# EAGLE design PCB_v1 (EAGLE 9.5.2)
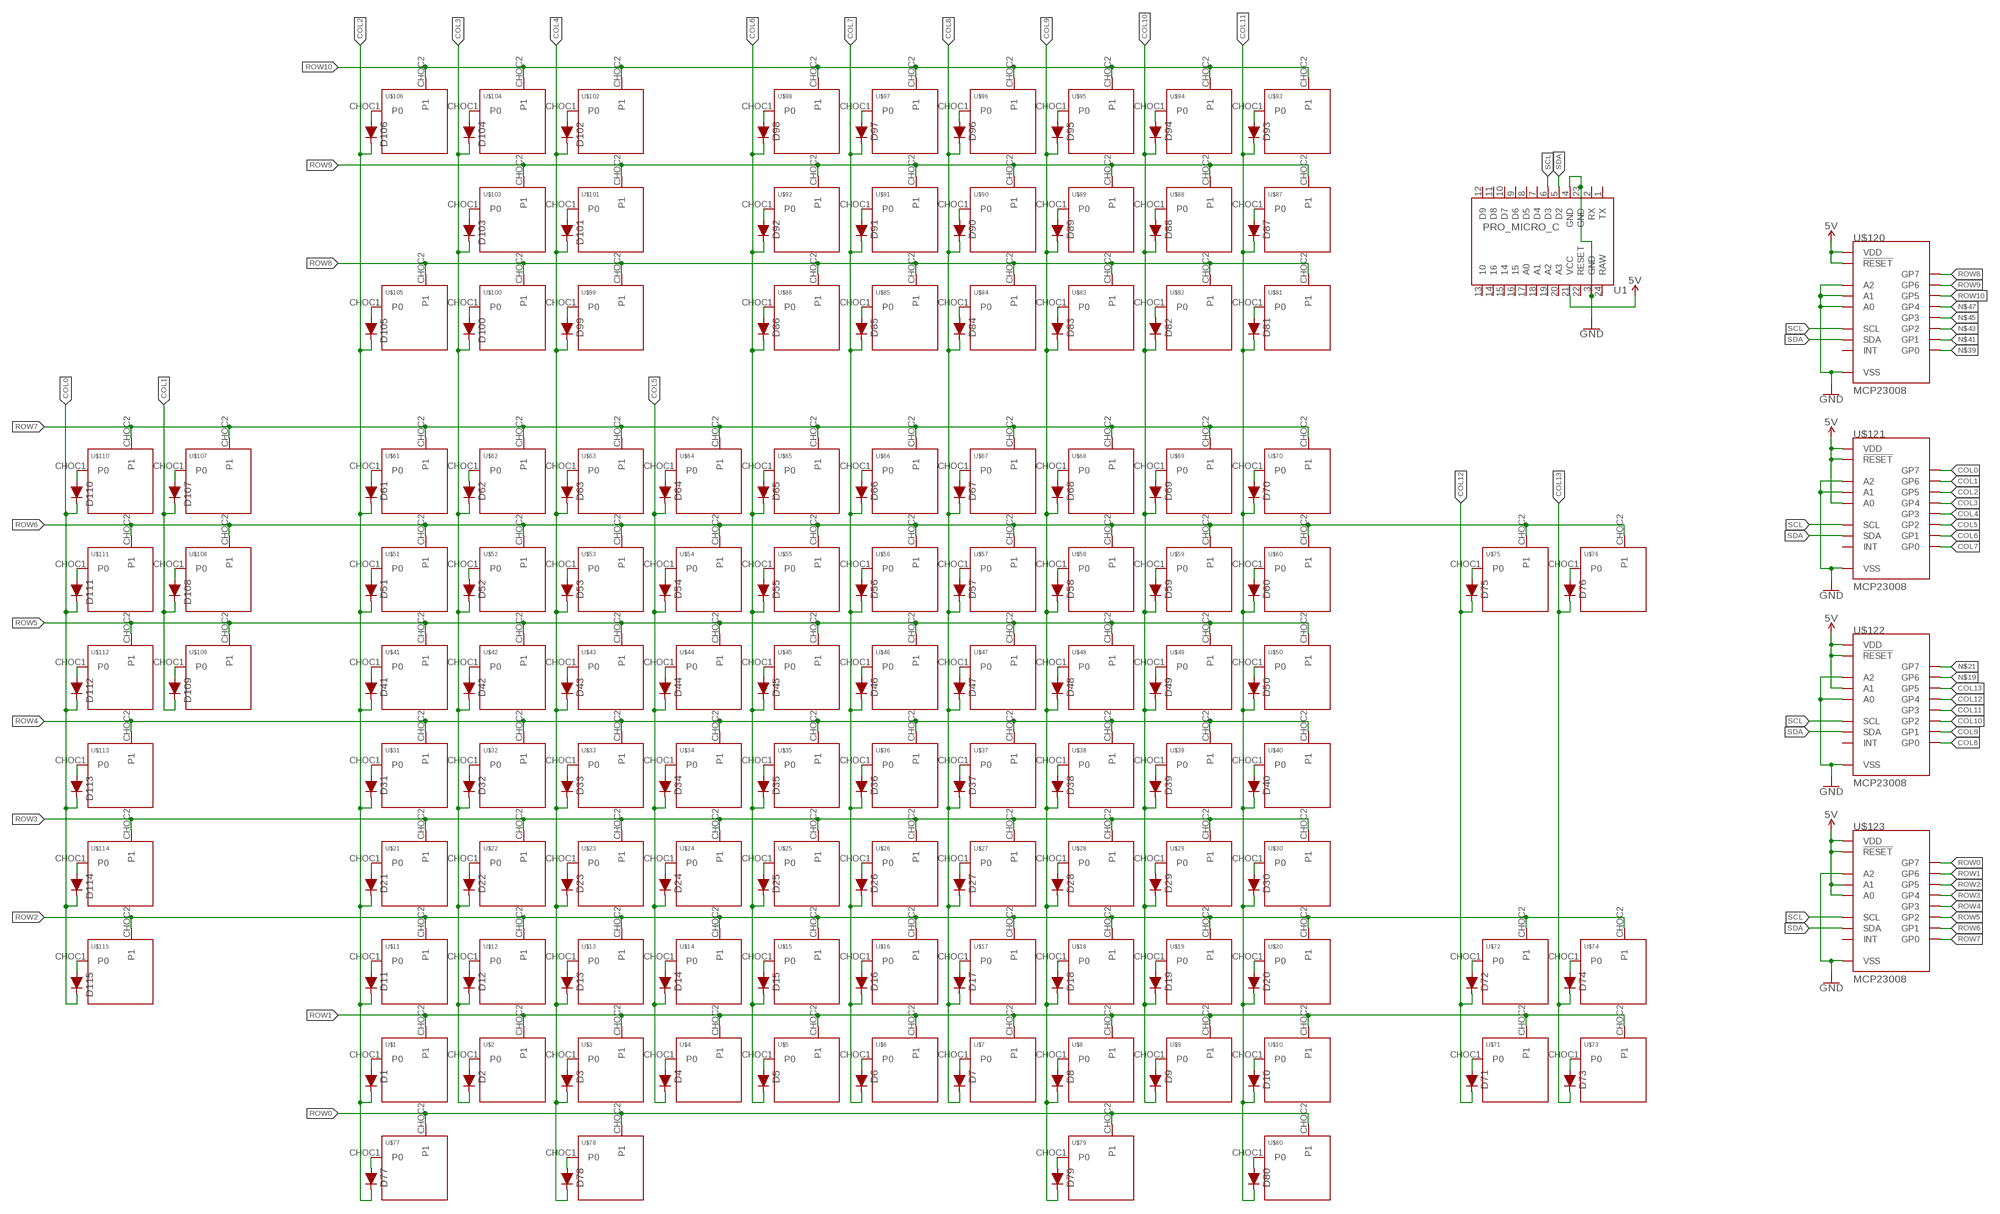
[diagram p0: schematic, sheet 1]

## Parts
D1  200mA/100V/1V  DIODE-KIT  [DIODE-1N4148-KIT]
D2  200mA/100V/1V  DIODE-KIT  [DIODE-1N4148-KIT]
D3  200mA/100V/1V  DIODE-KIT  [DIODE-1N4148-KIT]
D4  200mA/100V/1V  DIODE-KIT  [DIODE-1N4148-KIT]
D5  200mA/100V/1V  DIODE-KIT  [DIODE-1N4148-KIT]
D6  200mA/100V/1V  DIODE-KIT  [DIODE-1N4148-KIT]
D7  200mA/100V/1V  DIODE-KIT  [DIODE-1N4148-KIT]
D8  200mA/100V/1V  DIODE-KIT  [DIODE-1N4148-KIT]
D9  200mA/100V/1V  DIODE-KIT  [DIODE-1N4148-KIT]
D10  200mA/100V/1V  DIODE-KIT  [DIODE-1N4148-KIT]
D11  200mA/100V/1V  DIODE-KIT  [DIODE-1N4148-KIT]
D12  200mA/100V/1V  DIODE-KIT  [DIODE-1N4148-KIT]
D13  200mA/100V/1V  DIODE-KIT  [DIODE-1N4148-KIT]
D14  200mA/100V/1V  DIODE-KIT  [DIODE-1N4148-KIT]
D15  200mA/100V/1V  DIODE-KIT  [DIODE-1N4148-KIT]
D16  200mA/100V/1V  DIODE-KIT  [DIODE-1N4148-KIT]
D17  200mA/100V/1V  DIODE-KIT  [DIODE-1N4148-KIT]
D18  200mA/100V/1V  DIODE-KIT  [DIODE-1N4148-KIT]
D19  200mA/100V/1V  DIODE-KIT  [DIODE-1N4148-KIT]
D20  200mA/100V/1V  DIODE-KIT  [DIODE-1N4148-KIT]
D21  200mA/100V/1V  DIODE-KIT  [DIODE-1N4148-KIT]
D22  200mA/100V/1V  DIODE-KIT  [DIODE-1N4148-KIT]
D23  200mA/100V/1V  DIODE-KIT  [DIODE-1N4148-KIT]
D24  200mA/100V/1V  DIODE-KIT  [DIODE-1N4148-KIT]
D25  200mA/100V/1V  DIODE-KIT  [DIODE-1N4148-KIT]
D26  200mA/100V/1V  DIODE-KIT  [DIODE-1N4148-KIT]
D27  200mA/100V/1V  DIODE-KIT  [DIODE-1N4148-KIT]
D28  200mA/100V/1V  DIODE-KIT  [DIODE-1N4148-KIT]
D29  200mA/100V/1V  DIODE-KIT  [DIODE-1N4148-KIT]
D30  200mA/100V/1V  DIODE-KIT  [DIODE-1N4148-KIT]
D31  200mA/100V/1V  DIODE-KIT  [DIODE-1N4148-KIT]
D32  200mA/100V/1V  DIODE-KIT  [DIODE-1N4148-KIT]
D33  200mA/100V/1V  DIODE-KIT  [DIODE-1N4148-KIT]
D34  200mA/100V/1V  DIODE-KIT  [DIODE-1N4148-KIT]
D35  200mA/100V/1V  DIODE-KIT  [DIODE-1N4148-KIT]
D36  200mA/100V/1V  DIODE-KIT  [DIODE-1N4148-KIT]
D37  200mA/100V/1V  DIODE-KIT  [DIODE-1N4148-KIT]
D38  200mA/100V/1V  DIODE-KIT  [DIODE-1N4148-KIT]
D39  200mA/100V/1V  DIODE-KIT  [DIODE-1N4148-KIT]
D40  200mA/100V/1V  DIODE-KIT  [DIODE-1N4148-KIT]
D41  200mA/100V/1V  DIODE-KIT  [DIODE-1N4148-KIT]
D42  200mA/100V/1V  DIODE-KIT  [DIODE-1N4148-KIT]
D43  200mA/100V/1V  DIODE-KIT  [DIODE-1N4148-KIT]
D44  200mA/100V/1V  DIODE-KIT  [DIODE-1N4148-KIT]
D45  200mA/100V/1V  DIODE-KIT  [DIODE-1N4148-KIT]
D46  200mA/100V/1V  DIODE-KIT  [DIODE-1N4148-KIT]
D47  200mA/100V/1V  DIODE-KIT  [DIODE-1N4148-KIT]
D48  200mA/100V/1V  DIODE-KIT  [DIODE-1N4148-KIT]
D49  200mA/100V/1V  DIODE-KIT  [DIODE-1N4148-KIT]
D50  200mA/100V/1V  DIODE-KIT  [DIODE-1N4148-KIT]
D51  200mA/100V/1V  DIODE-KIT  [DIODE-1N4148-KIT]
D52  200mA/100V/1V  DIODE-KIT  [DIODE-1N4148-KIT]
D53  200mA/100V/1V  DIODE-KIT  [DIODE-1N4148-KIT]
D54  200mA/100V/1V  DIODE-KIT  [DIODE-1N4148-KIT]
D55  200mA/100V/1V  DIODE-KIT  [DIODE-1N4148-KIT]
D56  200mA/100V/1V  DIODE-KIT  [DIODE-1N4148-KIT]
D57  200mA/100V/1V  DIODE-KIT  [DIODE-1N4148-KIT]
D58  200mA/100V/1V  DIODE-KIT  [DIODE-1N4148-KIT]
D59  200mA/100V/1V  DIODE-KIT  [DIODE-1N4148-KIT]
D60  200mA/100V/1V  DIODE-KIT  [DIODE-1N4148-KIT]
D61  200mA/100V/1V  DIODE-KIT  [DIODE-1N4148-KIT]
D62  200mA/100V/1V  DIODE-KIT  [DIODE-1N4148-KIT]
D63  200mA/100V/1V  DIODE-KIT  [DIODE-1N4148-KIT]
D64  200mA/100V/1V  DIODE-KIT  [DIODE-1N4148-KIT]
D65  200mA/100V/1V  DIODE-KIT  [DIODE-1N4148-KIT]
D66  200mA/100V/1V  DIODE-KIT  [DIODE-1N4148-KIT]
D67  200mA/100V/1V  DIODE-KIT  [DIODE-1N4148-KIT]
D68  200mA/100V/1V  DIODE-KIT  [DIODE-1N4148-KIT]
D69  200mA/100V/1V  DIODE-KIT  [DIODE-1N4148-KIT]
D70  200mA/100V/1V  DIODE-KIT  [DIODE-1N4148-KIT]
D71  200mA/100V/1V  DIODE-KIT  [DIODE-1N4148-KIT]
D72  200mA/100V/1V  DIODE-KIT  [DIODE-1N4148-KIT]
D73  200mA/100V/1V  DIODE-KIT  [DIODE-1N4148-KIT]
D74  200mA/100V/1V  DIODE-KIT  [DIODE-1N4148-KIT]
D75  200mA/100V/1V  DIODE-KIT  [DIODE-1N4148-KIT]
D76  200mA/100V/1V  DIODE-KIT  [DIODE-1N4148-KIT]
D77  200mA/100V/1V  DIODE-KIT  [DIODE-1N4148-KIT]
D78  200mA/100V/1V  DIODE-KIT  [DIODE-1N4148-KIT]
D79  200mA/100V/1V  DIODE-KIT  [DIODE-1N4148-KIT]
D80  200mA/100V/1V  DIODE-KIT  [DIODE-1N4148-KIT]
D81  200mA/100V/1V  DIODE-KIT  [DIODE-1N4148-KIT]
D82  200mA/100V/1V  DIODE-KIT  [DIODE-1N4148-KIT]
D83  200mA/100V/1V  DIODE-KIT  [DIODE-1N4148-KIT]
D84  200mA/100V/1V  DIODE-KIT  [DIODE-1N4148-KIT]
D85  200mA/100V/1V  DIODE-KIT  [DIODE-1N4148-KIT]
D86  200mA/100V/1V  DIODE-KIT  [DIODE-1N4148-KIT]
D87  200mA/100V/1V  DIODE-KIT  [DIODE-1N4148-KIT]
D88  200mA/100V/1V  DIODE-KIT  [DIODE-1N4148-KIT]
D89  200mA/100V/1V  DIODE-KIT  [DIODE-1N4148-KIT]
D90  200mA/100V/1V  DIODE-KIT  [DIODE-1N4148-KIT]
D91  200mA/100V/1V  DIODE-KIT  [DIODE-1N4148-KIT]
D92  200mA/100V/1V  DIODE-KIT  [DIODE-1N4148-KIT]
D93  200mA/100V/1V  DIODE-KIT  [DIODE-1N4148-KIT]
D94  200mA/100V/1V  DIODE-KIT  [DIODE-1N4148-KIT]
D95  200mA/100V/1V  DIODE-KIT  [DIODE-1N4148-KIT]
D96  200mA/100V/1V  DIODE-KIT  [DIODE-1N4148-KIT]
D97  200mA/100V/1V  DIODE-KIT  [DIODE-1N4148-KIT]
D98  200mA/100V/1V  DIODE-KIT  [DIODE-1N4148-KIT]
D99  200mA/100V/1V  DIODE-KIT  [DIODE-1N4148-KIT]
D100  200mA/100V/1V  DIODE-KIT  [DIODE-1N4148-KIT]
D101  200mA/100V/1V  DIODE-KIT  [DIODE-1N4148-KIT]
D102  200mA/100V/1V  DIODE-KIT  [DIODE-1N4148-KIT]
D103  200mA/100V/1V  DIODE-KIT  [DIODE-1N4148-KIT]
D104  200mA/100V/1V  DIODE-KIT  [DIODE-1N4148-KIT]
D105  200mA/100V/1V  DIODE-KIT  [DIODE-1N4148-KIT]
D106  200mA/100V/1V  DIODE-KIT  [DIODE-1N4148-KIT]
D107  200mA/100V/1V  DIODE-KIT  [DIODE-1N4148-KIT]
D108  200mA/100V/1V  DIODE-KIT  [DIODE-1N4148-KIT]
D109  200mA/100V/1V  DIODE-KIT  [DIODE-1N4148-KIT]
D110  200mA/100V/1V  DIODE-KIT  [DIODE-1N4148-KIT]
D111  200mA/100V/1V  DIODE-KIT  [DIODE-1N4148-KIT]
D112  200mA/100V/1V  DIODE-KIT  [DIODE-1N4148-KIT]
D113  200mA/100V/1V  DIODE-KIT  [DIODE-1N4148-KIT]
D114  200mA/100V/1V  DIODE-KIT  [DIODE-1N4148-KIT]
D115  200mA/100V/1V  DIODE-KIT  [DIODE-1N4148-KIT]
U1  PRO_MICRO_C  [PRO_MICRO_C]
U$1  KEYSWITCH-PLAIN-CHOC-1U  [CHOC-1U]
U$2  KEYSWITCH-PLAIN-CHOC-1U  [CHOC-1U]
U$3  KEYSWITCH-PLAIN-CHOC-1U  [CHOC-1U]
U$4  KEYSWITCH-PLAIN-CHOC-1U  [CHOC-1U]
U$5  KEYSWITCH-PLAIN-CHOC-1U  [CHOC-1U]
U$6  KEYSWITCH-PLAIN-CHOC-1U  [CHOC-1U]
U$7  KEYSWITCH-PLAIN-CHOC-1U  [CHOC-1U]
U$8  KEYSWITCH-PLAIN-CHOC-1U  [CHOC-1U]
U$9  KEYSWITCH-PLAIN-CHOC-1U  [CHOC-1U]
U$10  KEYSWITCH-PLAIN-CHOC-1U  [CHOC-1U]
U$11  KEYSWITCH-PLAIN-CHOC-1U  [CHOC-1U]
U$12  KEYSWITCH-PLAIN-CHOC-1U  [CHOC-1U]
U$13  KEYSWITCH-PLAIN-CHOC-1U  [CHOC-1U]
U$14  KEYSWITCH-PLAIN-CHOC-1U  [CHOC-1U]
U$15  KEYSWITCH-PLAIN-CHOC-1U  [CHOC-1U]
U$16  KEYSWITCH-PLAIN-CHOC-1U  [CHOC-1U]
U$17  KEYSWITCH-PLAIN-CHOC-1U  [CHOC-1U]
U$18  KEYSWITCH-PLAIN-CHOC-1U  [CHOC-1U]
U$19  KEYSWITCH-PLAIN-CHOC-1U  [CHOC-1U]
U$20  KEYSWITCH-PLAIN-CHOC-1U  [CHOC-1U]
U$21  KEYSWITCH-PLAIN-CHOC-1U  [CHOC-1U]
U$22  KEYSWITCH-PLAIN-CHOC-1U  [CHOC-1U]
U$23  KEYSWITCH-PLAIN-CHOC-1U  [CHOC-1U]
U$24  KEYSWITCH-PLAIN-CHOC-1U  [CHOC-1U]
U$25  KEYSWITCH-PLAIN-CHOC-1U  [CHOC-1U]
U$26  KEYSWITCH-PLAIN-CHOC-1U  [CHOC-1U]
U$27  KEYSWITCH-PLAIN-CHOC-1U  [CHOC-1U]
U$28  KEYSWITCH-PLAIN-CHOC-1U  [CHOC-1U]
U$29  KEYSWITCH-PLAIN-CHOC-1U  [CHOC-1U]
U$30  KEYSWITCH-PLAIN-CHOC-1U  [CHOC-1U]
U$31  KEYSWITCH-PLAIN-CHOC-1U  [CHOC-1U]
U$32  KEYSWITCH-PLAIN-CHOC-1U  [CHOC-1U]
U$33  KEYSWITCH-PLAIN-CHOC-1U  [CHOC-1U]
U$34  KEYSWITCH-PLAIN-CHOC-1U  [CHOC-1U]
U$35  KEYSWITCH-PLAIN-CHOC-1U  [CHOC-1U]
U$36  KEYSWITCH-PLAIN-CHOC-1U  [CHOC-1U]
U$37  KEYSWITCH-PLAIN-CHOC-1U  [CHOC-1U]
U$38  KEYSWITCH-PLAIN-CHOC-1U  [CHOC-1U]
U$39  KEYSWITCH-PLAIN-CHOC-1U  [CHOC-1U]
U$40  KEYSWITCH-PLAIN-CHOC-1U  [CHOC-1U]
U$41  KEYSWITCH-PLAIN-CHOC-1U  [CHOC-1U]
U$42  KEYSWITCH-PLAIN-CHOC-1U  [CHOC-1U]
U$43  KEYSWITCH-PLAIN-CHOC-1U  [CHOC-1U]
U$44  KEYSWITCH-PLAIN-CHOC-1U  [CHOC-1U]
U$45  KEYSWITCH-PLAIN-CHOC-1U  [CHOC-1U]
U$46  KEYSWITCH-PLAIN-CHOC-1U  [CHOC-1U]
U$47  KEYSWITCH-PLAIN-CHOC-1U  [CHOC-1U]
U$48  KEYSWITCH-PLAIN-CHOC-1U  [CHOC-1U]
U$49  KEYSWITCH-PLAIN-CHOC-1U  [CHOC-1U]
U$50  KEYSWITCH-PLAIN-CHOC-1U  [CHOC-1U]
U$51  KEYSWITCH-PLAIN-CHOC-1U  [CHOC-1U]
U$52  KEYSWITCH-PLAIN-CHOC-1U  [CHOC-1U]
U$53  KEYSWITCH-PLAIN-CHOC-1U  [CHOC-1U]
U$54  KEYSWITCH-PLAIN-CHOC-1U  [CHOC-1U]
U$55  KEYSWITCH-PLAIN-CHOC-1U  [CHOC-1U]
U$56  KEYSWITCH-PLAIN-CHOC-1U  [CHOC-1U]
U$57  KEYSWITCH-PLAIN-CHOC-1U  [CHOC-1U]
U$58  KEYSWITCH-PLAIN-CHOC-1U  [CHOC-1U]
U$59  KEYSWITCH-PLAIN-CHOC-1U  [CHOC-1U]
U$60  KEYSWITCH-PLAIN-CHOC-1U  [CHOC-1U]
U$61  KEYSWITCH-PLAIN-CHOC-1U  [CHOC-1U]
U$62  KEYSWITCH-PLAIN-CHOC-1U  [CHOC-1U]
U$63  KEYSWITCH-PLAIN-CHOC-1U  [CHOC-1U]
U$64  KEYSWITCH-PLAIN-CHOC-1U  [CHOC-1U]
U$65  KEYSWITCH-PLAIN-CHOC-1U  [CHOC-1U]
U$66  KEYSWITCH-PLAIN-CHOC-1U  [CHOC-1U]
U$67  KEYSWITCH-PLAIN-CHOC-1U  [CHOC-1U]
U$68  KEYSWITCH-PLAIN-CHOC-1U  [CHOC-1U]
U$69  KEYSWITCH-PLAIN-CHOC-1U  [CHOC-1U]
U$70  KEYSWITCH-PLAIN-CHOC-1U  [CHOC-1U]
U$71  KEYSWITCH-PLAIN-CHOC-1U  [CHOC-1U]
U$72  KEYSWITCH-PLAIN-CHOC-1U  [CHOC-1U]
U$73  KEYSWITCH-PLAIN-CHOC-1U  [CHOC-1U]
U$74  KEYSWITCH-PLAIN-CHOC-1U  [CHOC-1U]
U$75  KEYSWITCH-PLAIN-CHOC-1U  [CHOC-1U]
U$76  KEYSWITCH-PLAIN-CHOC-1U  [CHOC-1U]
U$77  KEYSWITCH-PLAIN-CHOC-1U  [CHOC-1U]
U$78  KEYSWITCH-PLAIN-CHOC-1U  [CHOC-1U]
U$79  KEYSWITCH-PLAIN-CHOC-1U  [CHOC-1U]
U$80  KEYSWITCH-PLAIN-CHOC-1U  [CHOC-1U]
U$81  KEYSWITCH-PLAIN-CHOC-1U  [CHOC-1U]
U$82  KEYSWITCH-PLAIN-CHOC-1U  [CHOC-1U]
U$83  KEYSWITCH-PLAIN-CHOC-1U  [CHOC-1U]
U$84  KEYSWITCH-PLAIN-CHOC-1U  [CHOC-1U]
U$85  KEYSWITCH-PLAIN-CHOC-1U  [CHOC-1U]
U$86  KEYSWITCH-PLAIN-CHOC-1U  [CHOC-1U]
U$87  KEYSWITCH-PLAIN-CHOC-1U  [CHOC-1U]
U$88  KEYSWITCH-PLAIN-CHOC-1U  [CHOC-1U]
U$89  KEYSWITCH-PLAIN-CHOC-1U  [CHOC-1U]
U$90  KEYSWITCH-PLAIN-CHOC-1U  [CHOC-1U]
U$91  KEYSWITCH-PLAIN-CHOC-1U  [CHOC-1U]
U$92  KEYSWITCH-PLAIN-CHOC-1U  [CHOC-1U]
U$93  KEYSWITCH-PLAIN-CHOC-1U  [CHOC-1U]
U$94  KEYSWITCH-PLAIN-CHOC-1U  [CHOC-1U]
U$95  KEYSWITCH-PLAIN-CHOC-1U  [CHOC-1U]
U$96  KEYSWITCH-PLAIN-CHOC-1U  [CHOC-1U]
U$97  KEYSWITCH-PLAIN-CHOC-1U  [CHOC-1U]
U$98  KEYSWITCH-PLAIN-CHOC-1U  [CHOC-1U]
U$99  KEYSWITCH-PLAIN-CHOC-1U  [CHOC-1U]
U$100  KEYSWITCH-PLAIN-CHOC-1U  [CHOC-1U]
U$101  KEYSWITCH-PLAIN-CHOC-1U  [CHOC-1U]
U$102  KEYSWITCH-PLAIN-CHOC-1U  [CHOC-1U]
U$103  KEYSWITCH-PLAIN-CHOC-1U  [CHOC-1U]
U$104  KEYSWITCH-PLAIN-CHOC-1U  [CHOC-1U]
U$105  KEYSWITCH-PLAIN-CHOC-1U  [CHOC-1U]
U$106  KEYSWITCH-PLAIN-CHOC-1U  [CHOC-1U]
U$107  KEYSWITCH-PLAIN-CHOC-1U  [CHOC-1U]
U$108  KEYSWITCH-PLAIN-CHOC-1U  [CHOC-1U]
U$109  KEYSWITCH-PLAIN-CHOC-1U  [CHOC-1U]
U$110  KEYSWITCH-PLAIN-CHOC-1U  [CHOC-1U]
U$111  KEYSWITCH-PLAIN-CHOC-1U  [CHOC-1U]
U$112  KEYSWITCH-PLAIN-CHOC-1U  [CHOC-1U]
U$113  KEYSWITCH-PLAIN-CHOC-1U  [CHOC-1U]
U$114  KEYSWITCH-PLAIN-CHOC-1U  [CHOC-1U]
U$115  KEYSWITCH-PLAIN-CHOC-1U  [CHOC-1U]
U$120  MCP23008  [DIP18]
U$121  MCP23008  [DIP18]
U$122  MCP23008  [DIP18]
U$123  MCP23008  [DIP18]

## Nets
5V: U1.21(VCC) U$120.6(!RESET) U$120.18(VDD) U$121.5(A0) U$121.6(!RESET) U$121.18(VDD) U$122.4(A1) U$122.6(!RESET) U$122.18(VDD) U$123.4(A1) U$123.5(A0) U$123.6(!RESET) U$123.18(VDD)
COL0: D110.C D111.C D112.C D113.C D114.C D115.C U$121.17(GP7)
COL1: D107.C D108.C D109.C U$121.16(GP6)
COL2: D1.C D11.C D21.C D31.C D41.C D51.C D61.C D77.C D105.C D106.C U$121.15(GP5)
COL3: D2.C D12.C D22.C D32.C D42.C D52.C D62.C D100.C D103.C D104.C U$121.14(GP4)
COL4: D3.C D13.C D23.C D33.C D43.C D53.C D63.C D78.C D99.C D101.C D102.C U$121.13(GP3)
COL5: D4.C D14.C D24.C D34.C D44.C D54.C D64.C U$121.12(GP2)
COL6: D5.C D15.C D25.C D35.C D45.C D55.C D65.C D86.C D92.C D98.C U$121.11(GP1)
COL7: D6.C D16.C D26.C D36.C D46.C D56.C D66.C D85.C D91.C D97.C U$121.10(GP0)
COL8: D7.C D17.C D27.C D37.C D47.C D57.C D67.C D84.C D90.C D96.C U$122.10(GP0)
COL9: D8.C D18.C D28.C D38.C D48.C D58.C D68.C D79.C D83.C D89.C D95.C U$122.11(GP1)
COL10: D9.C D19.C D29.C D39.C D49.C D59.C D69.C D82.C D88.C D94.C U$122.12(GP2)
COL11: D10.C D20.C D30.C D40.C D50.C D60.C D70.C D80.C D81.C D87.C D93.C U$122.13(GP3)
COL12: D71.C D72.C D75.C U$122.14(GP4)
COL13: D73.C D74.C D76.C U$122.15(GP5)
GND: U1.3(GND) U1.4(GND) U1.23(GND) U$120.3(A2) U$120.4(A1) U$120.5(A0) U$120.9(VSS) U$121.3(A2) U$121.4(A1) U$121.9(VSS) U$122.3(A2) U$122.5(A0) U$122.9(VSS) U$123.3(A2) U$123.9(VSS)
N$12: D77.A U$77.CHOC1(P0)
N$13: D78.A U$78.CHOC1(P0)
N$14: D79.A U$79.CHOC1(P0)
N$15: D80.A U$80.CHOC1(P0)
N$19: U$122.16(GP6)
N$20: D73.A U$73.CHOC1(P0)
N$21: U$122.17(GP7)
N$22: D71.A U$71.CHOC1(P0)
N$24: D72.A U$72.CHOC1(P0)
N$26: D74.A U$74.CHOC1(P0)
N$28: D20.A U$20.CHOC1(P0)
N$30: D10.A U$10.CHOC1(P0)
N$32: D9.A U$9.CHOC1(P0)
N$34: D8.A U$8.CHOC1(P0)
N$36: D7.A U$7.CHOC1(P0)
N$38: D17.A U$17.CHOC1(P0)
N$39: U$120.10(GP0)
N$40: D18.A U$18.CHOC1(P0)
N$41: U$120.11(GP1)
N$42: D19.A U$19.CHOC1(P0)
N$43: U$120.12(GP2)
N$44: D16.A U$16.CHOC1(P0)
N$45: U$120.13(GP3)
N$46: D6.A U$6.CHOC1(P0)
N$47: U$120.14(GP4)
N$48: D5.A U$5.CHOC1(P0)
N$50: D4.A U$4.CHOC1(P0)
N$52: D3.A U$3.CHOC1(P0)
N$54: D15.A U$15.CHOC1(P0)
N$56: D14.A U$14.CHOC1(P0)
N$58: D13.A U$13.CHOC1(P0)
N$60: D12.A U$12.CHOC1(P0)
N$62: D2.A U$2.CHOC1(P0)
N$64: D1.A U$1.CHOC1(P0)
N$67: D11.A U$11.CHOC1(P0)
N$68: D50.A U$50.CHOC1(P0)
N$70: D40.A U$40.CHOC1(P0)
N$72: D30.A U$30.CHOC1(P0)
N$75: D29.A U$29.CHOC1(P0)
N$76: D39.A U$39.CHOC1(P0)
N$78: D49.A U$49.CHOC1(P0)
N$80: D48.A U$48.CHOC1(P0)
N$82: D38.A U$38.CHOC1(P0)
N$84: D28.A U$28.CHOC1(P0)
N$86: D27.A U$27.CHOC1(P0)
N$88: D37.A U$37.CHOC1(P0)
N$90: D47.A U$47.CHOC1(P0)
N$92: D46.A U$46.CHOC1(P0)
N$94: D36.A U$36.CHOC1(P0)
N$96: D26.A U$26.CHOC1(P0)
N$98: D25.A U$25.CHOC1(P0)
N$100: D35.A U$35.CHOC1(P0)
N$102: D45.A U$45.CHOC1(P0)
N$104: D44.A U$44.CHOC1(P0)
N$105: D43.A U$43.CHOC1(P0)
N$106: D42.A U$42.CHOC1(P0)
N$107: D41.A U$41.CHOC1(P0)
N$108: D31.A U$31.CHOC1(P0)
N$109: D32.A U$32.CHOC1(P0)
N$110: D33.A U$33.CHOC1(P0)
N$111: D34.A U$34.CHOC1(P0)
N$112: D24.A U$24.CHOC1(P0)
N$113: D23.A U$23.CHOC1(P0)
N$114: D22.A U$22.CHOC1(P0)
N$115: D21.A U$21.CHOC1(P0)
N$128: D70.A U$70.CHOC1(P0)
N$129: D69.A U$69.CHOC1(P0)
N$130: D68.A U$68.CHOC1(P0)
N$131: D67.A U$67.CHOC1(P0)
N$132: D66.A U$66.CHOC1(P0)
N$133: D56.A U$56.CHOC1(P0)
N$134: D57.A U$57.CHOC1(P0)
N$135: D58.A U$58.CHOC1(P0)
N$136: D59.A U$59.CHOC1(P0)
N$137: D60.A U$60.CHOC1(P0)
N$148: D65.A U$65.CHOC1(P0)
N$149: D55.A U$55.CHOC1(P0)
N$150: D54.A U$54.CHOC1(P0)
N$151: D64.A U$64.CHOC1(P0)
N$152: D63.A U$63.CHOC1(P0)
N$153: D53.A U$53.CHOC1(P0)
N$154: D52.A U$52.CHOC1(P0)
N$155: D62.A U$62.CHOC1(P0)
N$156: D61.A U$61.CHOC1(P0)
N$157: D51.A U$51.CHOC1(P0)
N$168: D107.A U$107.CHOC1(P0)
N$169: D108.A U$108.CHOC1(P0)
N$170: D111.A U$111.CHOC1(P0)
N$171: D110.A U$110.CHOC1(P0)
N$176: D109.A U$109.CHOC1(P0)
N$177: D112.A U$112.CHOC1(P0)
N$178: D113.A U$113.CHOC1(P0)
N$179: D114.A U$114.CHOC1(P0)
N$184: D115.A U$115.CHOC1(P0)
N$186: D76.A U$76.CHOC1(P0)
N$188: D75.A U$75.CHOC1(P0)
N$190: D93.A U$93.CHOC1(P0)
N$191: D87.A U$87.CHOC1(P0)
N$192: D81.A U$81.CHOC1(P0)
N$193: D82.A U$82.CHOC1(P0)
N$194: D88.A U$88.CHOC1(P0)
N$195: D94.A U$94.CHOC1(P0)
N$196: D95.A U$95.CHOC1(P0)
N$197: D89.A U$89.CHOC1(P0)
N$198: D83.A U$83.CHOC1(P0)
N$199: D84.A U$84.CHOC1(P0)
N$200: D90.A U$90.CHOC1(P0)
N$201: D96.A U$96.CHOC1(P0)
N$202: D97.A U$97.CHOC1(P0)
N$203: D98.A U$98.CHOC1(P0)
N$204: D92.A U$92.CHOC1(P0)
N$205: D91.A U$91.CHOC1(P0)
N$206: D85.A U$85.CHOC1(P0)
N$207: D86.A U$86.CHOC1(P0)
N$226: D102.A U$102.CHOC1(P0)
N$227: D104.A U$104.CHOC1(P0)
N$228: D106.A U$106.CHOC1(P0)
N$229: D103.A U$103.CHOC1(P0)
N$230: D101.A U$101.CHOC1(P0)
N$231: D99.A U$99.CHOC1(P0)
N$232: D100.A U$100.CHOC1(P0)
N$233: D105.A U$105.CHOC1(P0)
ROW0: U$77.CHOC2(P1) U$78.CHOC2(P1) U$79.CHOC2(P1) U$80.CHOC2(P1) U$123.17(GP7)
ROW1: U$1.CHOC2(P1) U$2.CHOC2(P1) U$3.CHOC2(P1) U$4.CHOC2(P1) U$5.CHOC2(P1) U$6.CHOC2(P1) U$7.CHOC2(P1) U$8.CHOC2(P1) U$9.CHOC2(P1) U$10.CHOC2(P1) U$71.CHOC2(P1) U$73.CHOC2(P1) U$123.16(GP6)
ROW2: U$11.CHOC2(P1) U$12.CHOC2(P1) U$13.CHOC2(P1) U$14.CHOC2(P1) U$15.CHOC2(P1) U$16.CHOC2(P1) U$17.CHOC2(P1) U$18.CHOC2(P1) U$19.CHOC2(P1) U$20.CHOC2(P1) U$72.CHOC2(P1) U$74.CHOC2(P1) U$115.CHOC2(P1) U$123.15(GP5)
ROW3: U$21.CHOC2(P1) U$22.CHOC2(P1) U$23.CHOC2(P1) U$24.CHOC2(P1) U$25.CHOC2(P1) U$26.CHOC2(P1) U$27.CHOC2(P1) U$28.CHOC2(P1) U$29.CHOC2(P1) U$30.CHOC2(P1) U$114.CHOC2(P1) U$123.14(GP4)
ROW4: U$31.CHOC2(P1) U$32.CHOC2(P1) U$33.CHOC2(P1) U$34.CHOC2(P1) U$35.CHOC2(P1) U$36.CHOC2(P1) U$37.CHOC2(P1) U$38.CHOC2(P1) U$39.CHOC2(P1) U$40.CHOC2(P1) U$113.CHOC2(P1) U$123.13(GP3)
ROW5: U$41.CHOC2(P1) U$42.CHOC2(P1) U$43.CHOC2(P1) U$44.CHOC2(P1) U$45.CHOC2(P1) U$46.CHOC2(P1) U$47.CHOC2(P1) U$48.CHOC2(P1) U$49.CHOC2(P1) U$50.CHOC2(P1) U$109.CHOC2(P1) U$112.CHOC2(P1) U$123.12(GP2)
ROW6: U$51.CHOC2(P1) U$52.CHOC2(P1) U$53.CHOC2(P1) U$54.CHOC2(P1) U$55.CHOC2(P1) U$56.CHOC2(P1) U$57.CHOC2(P1) U$58.CHOC2(P1) U$59.CHOC2(P1) U$60.CHOC2(P1) U$75.CHOC2(P1) U$76.CHOC2(P1) U$108.CHOC2(P1) U$111.CHOC2(P1) U$123.11(GP1)
ROW7: U$61.CHOC2(P1) U$62.CHOC2(P1) U$63.CHOC2(P1) U$64.CHOC2(P1) U$65.CHOC2(P1) U$66.CHOC2(P1) U$67.CHOC2(P1) U$68.CHOC2(P1) U$69.CHOC2(P1) U$70.CHOC2(P1) U$107.CHOC2(P1) U$110.CHOC2(P1) U$123.10(GP0)
ROW8: U$81.CHOC2(P1) U$82.CHOC2(P1) U$83.CHOC2(P1) U$84.CHOC2(P1) U$85.CHOC2(P1) U$86.CHOC2(P1) U$99.CHOC2(P1) U$100.CHOC2(P1) U$105.CHOC2(P1) U$120.17(GP7)
ROW9: U$87.CHOC2(P1) U$88.CHOC2(P1) U$89.CHOC2(P1) U$90.CHOC2(P1) U$91.CHOC2(P1) U$92.CHOC2(P1) U$101.CHOC2(P1) U$103.CHOC2(P1) U$120.16(GP6)
ROW10: U$93.CHOC2(P1) U$94.CHOC2(P1) U$95.CHOC2(P1) U$96.CHOC2(P1) U$97.CHOC2(P1) U$98.CHOC2(P1) U$102.CHOC2(P1) U$104.CHOC2(P1) U$106.CHOC2(P1) U$120.15(GP5)
SCL: U1.6(D3) U$120.1(SCL) U$121.1(SCL) U$122.1(SCL) U$123.1(SCL)
SDA: U1.5(D2) U$120.2(SDA) U$121.2(SDA) U$122.2(SDA) U$123.2(SDA)
Unconnected: U1.1(TX) U1.2(RX) U1.7(D4) U1.8(D5) U1.9(D6) U1.10(D7) U1.11(D8) U1.12(D9) U1.13 U1.14 U1.15 U1.16 U1.17(A0) U1.18(A1) U1.19(A2) U1.20(A3) U1.22(RESET) U1.24(RAW) U$120.8(INT) U$121.8(INT) U$122.8(INT) U$123.8(INT)

## Library data of the parts
D1-D115 = SparkFun-DiscreteSemi:DIODE: Diode These are standard reverse protection diodes and small signal diodes. SparkFun Products: SparkFun SparkPunk Sound Kit <https://www.sparkfun.com/products/11177> SparkFun ESP8266 Thing <https://www.sparkfun.com/products/13231>; PROD_ID: DIO-08378
U1 = SparkFun-Boards:PRO_MICRO_C
U$1-U$115 = Keyboard:KEYSWITCH-PLAIN
U$120-U$123 = SparkFun-IC-Conversion:MCP23008

## Board
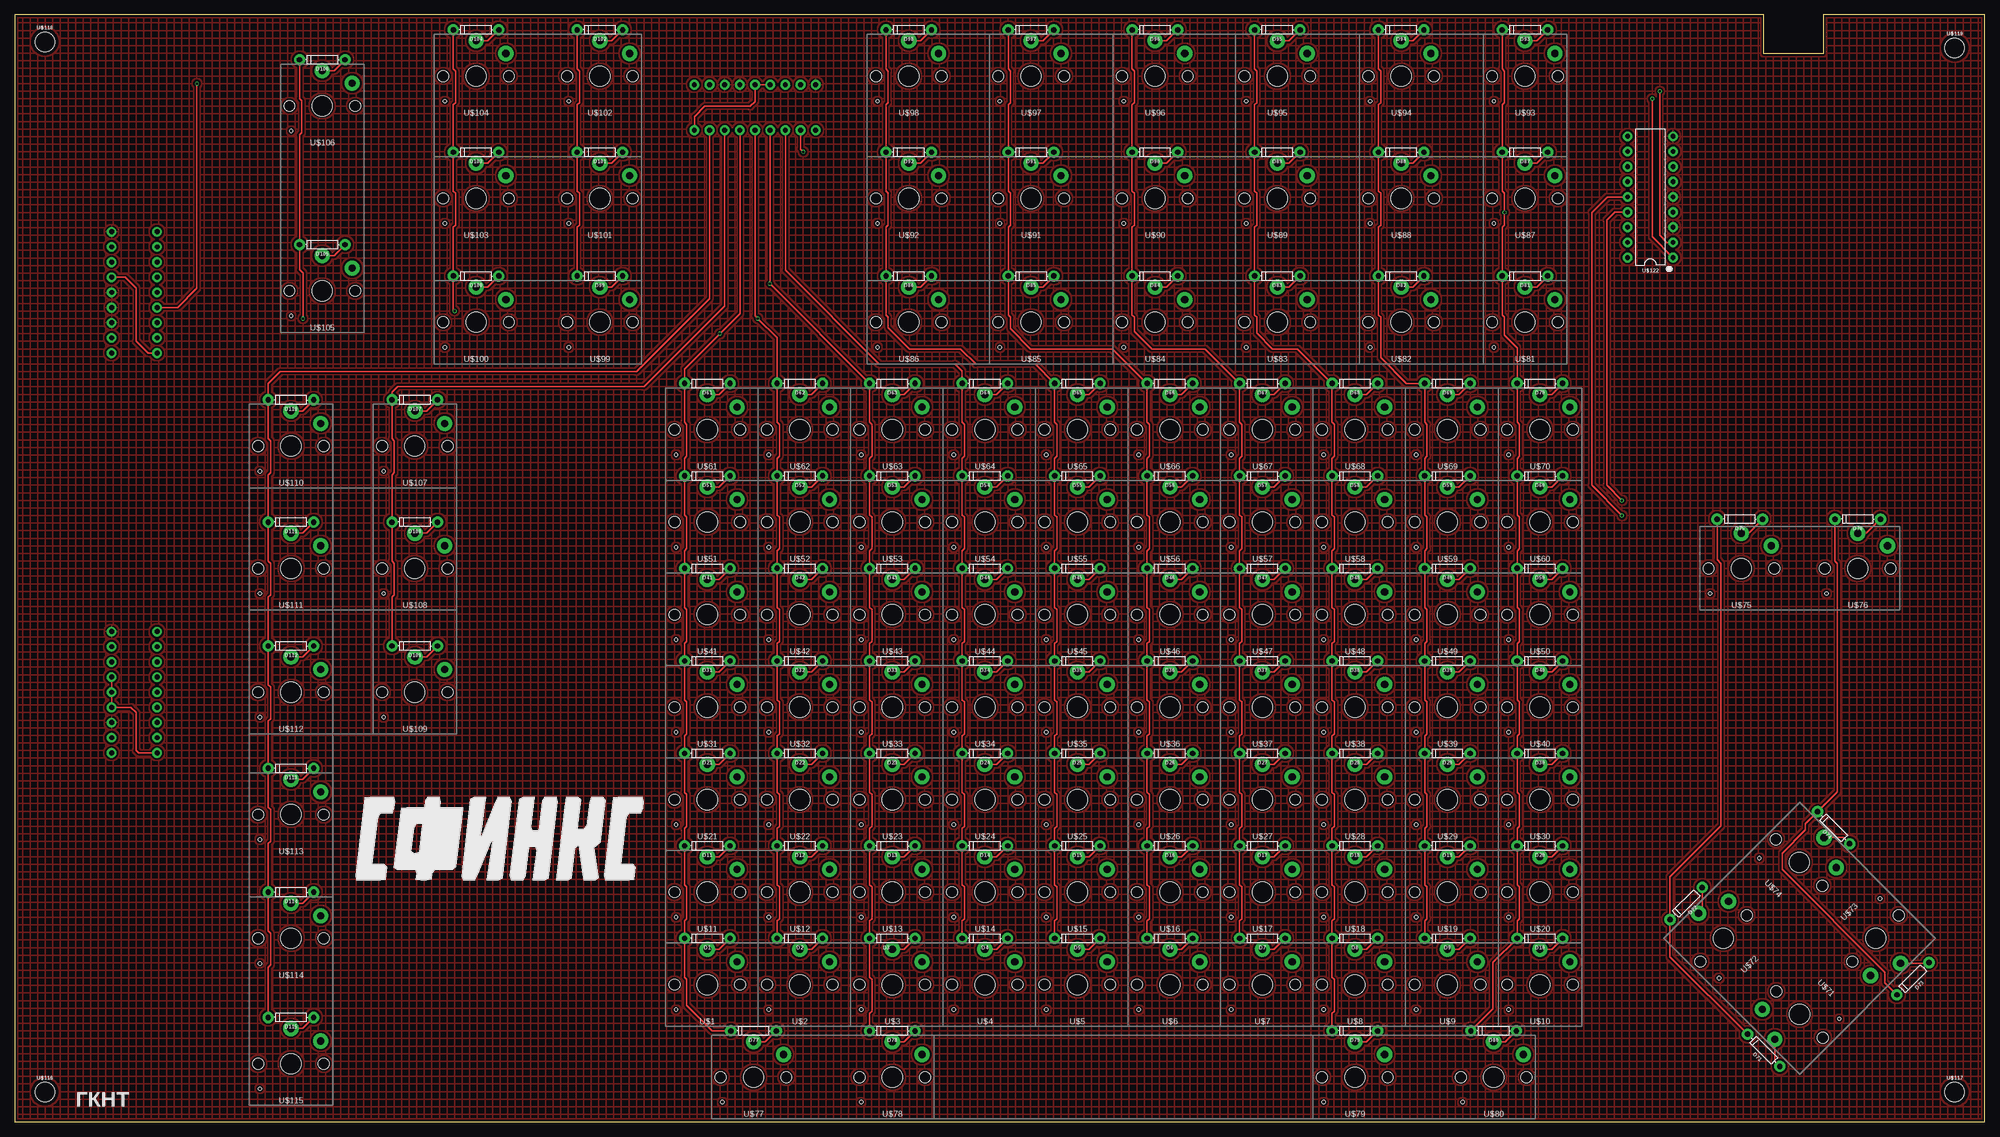
[diagram p1: board, top side]
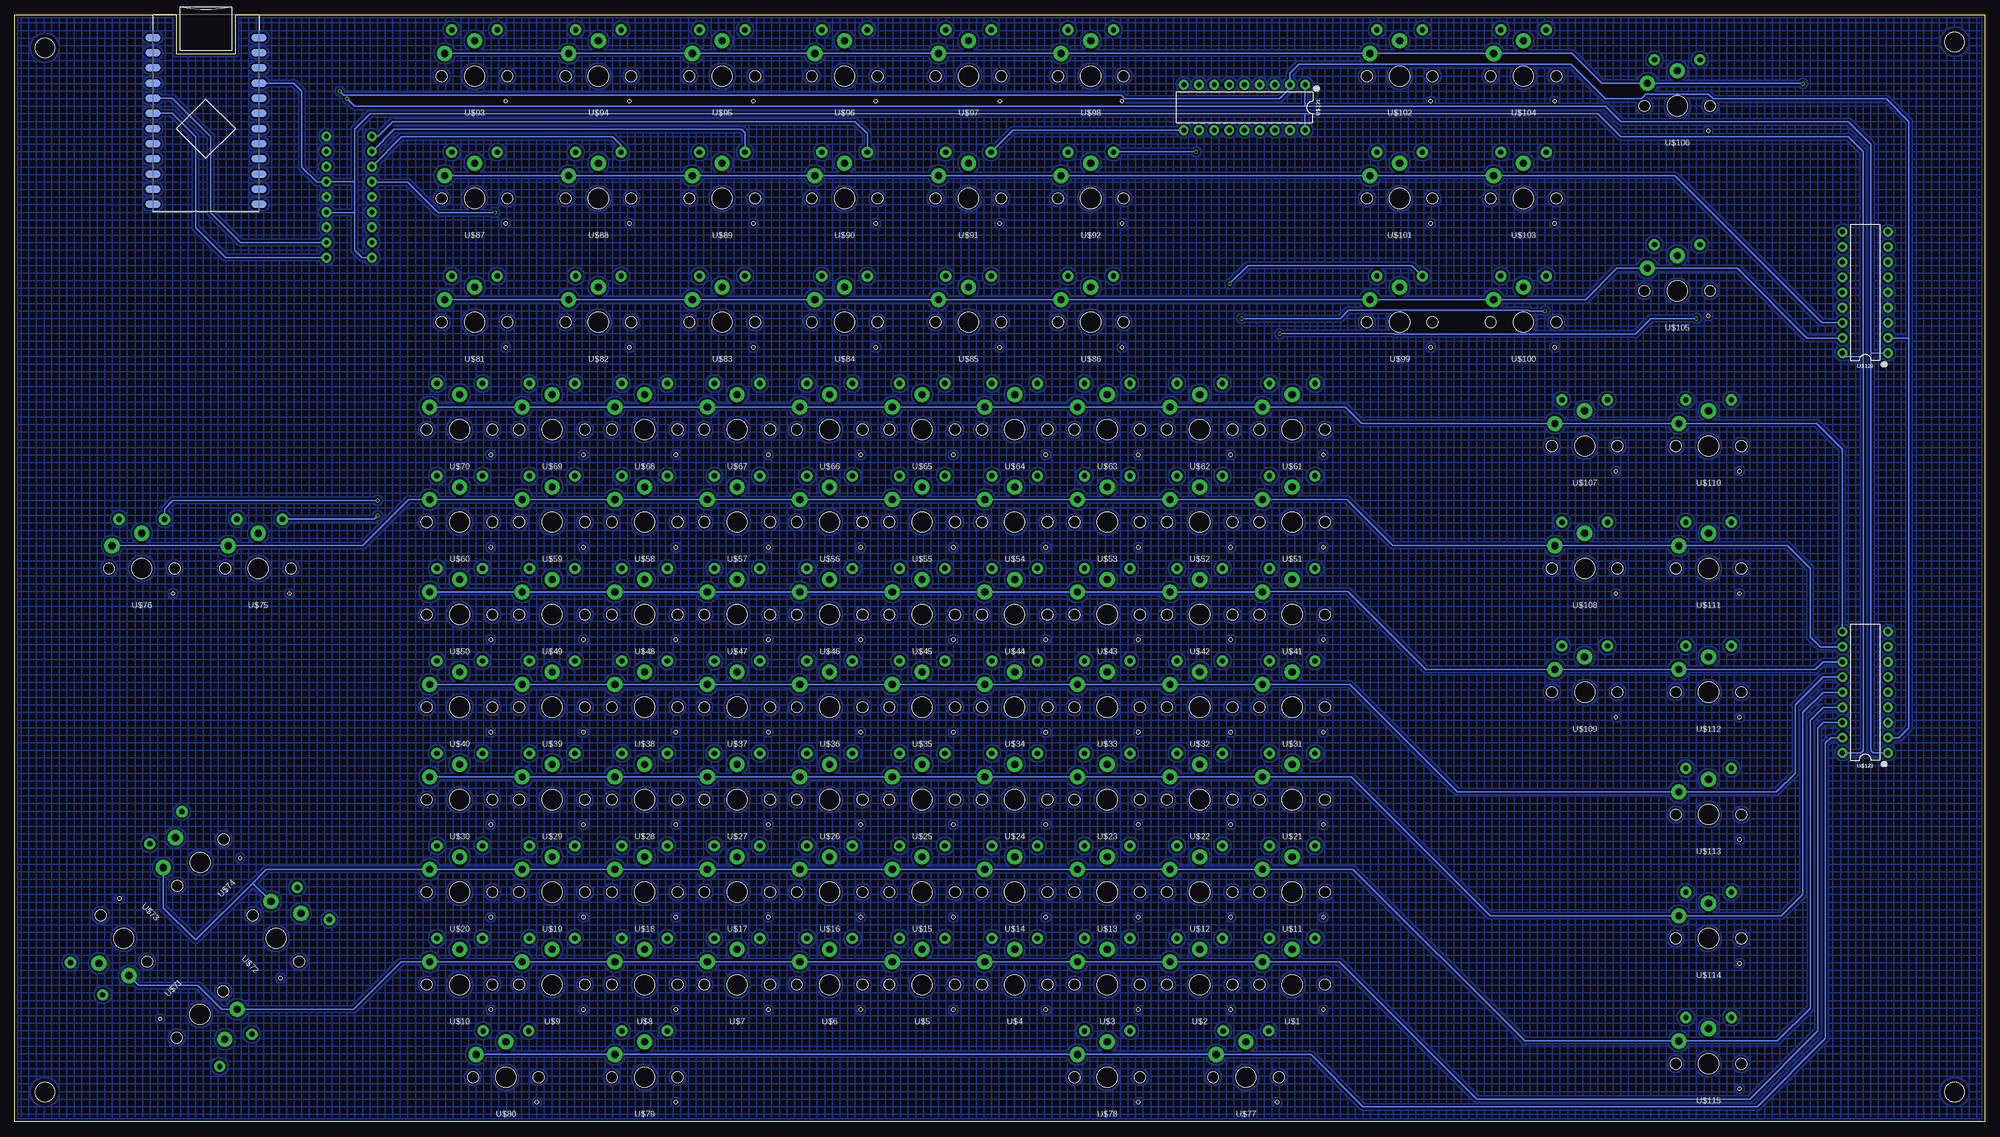
[diagram p2: board, bottom side, seen from below]

Size 330 x 185.5 mm. Coordinates in mm from the lower left corner, seen from the top.
Outline: 0,0 330,0 330,185.5 303,185.5 303,179 293,179 293,185.5 0,185.5 0,0
Copper layers (1*16): Top 0.035mm / dielectric 1.5mm / Bottom 0.035mm
Design rules "SparkFun-2-Layer-Minimum-JLCPCB": minimum track width 5mil, minimum drill 0.3mm, track to track 5mil, track to pad 5mil, pad to pad 5mil, via to via 5mil, smd to smd 5mil, copper to edge 7mil, drill to drill 7mil, minimum pad ring 5mil, minimum via ring 5mil, stop-mask expansion 4mil, vias tented up to drill 25mil, thermal gap 10mil

### Footprints (pad centres in the part's own frame; a part is rotated, then mirrored left to right if it is on the bottom)
DIODE-1N4148-KIT = drill 0.9 pad 1.88: A -3.81,0; C 3.81,0
PRO_MICRO_C = smd 2.54 x 1.27: 1 -8.89,12.7; 2 -8.89,10.16; 3 -8.89,7.62; 4 -8.89,5.08; 5 -8.89,2.54; 6 -8.89,0; 7 -8.89,-2.54; 8 -8.89,-5.08; 9 -8.89,-7.62; 10 -8.89,-10.16; 11 -8.89,-12.7; 12 -8.89,-15.24; 13 8.89,-15.24; 14 8.89,-12.7; 15 8.89,-10.16; 16 8.89,-7.62; 17 8.89,-5.08; 18 8.89,-2.54; 19 8.89,0; 20 8.89,2.54; 21 8.89,5.08; 22 8.89,7.62; 23 8.89,10.16; 24 8.89,12.7
CHOC-1U = drill 1.2 pad 2.54: CHOC1 0,5.9; CHOC2 5,3.8 | hole 3.4: 0,0 | hole 0.6: -5.22,-4.2 | hole 1.85: -5.5,0; 5.5,0
STAND-OFF = hole 3.302: 0,0
DIP18 = drill 0.813 pad 1.626: 1 -10.16,-3.81; 2 -7.62,-3.81; 3 -5.08,-3.81; 4 -2.54,-3.81; 5 0,-3.81; 6 2.54,-3.81; 7 5.08,-3.81; 8 7.62,-3.81; 9 10.16,-3.81; 10 10.16,3.81; 11 7.62,3.81; 12 5.08,3.81; 13 2.54,3.81; 14 0,3.81; 15 -2.54,3.81; 16 -5.08,3.81; 17 -7.62,3.81; 18 -10.16,3.81

### Placement (x,y rotation side)
D1  116,30.75 180 top
D2  131.5,30.75 180 top
D3  147,30.75 180 top
D4  162.5,30.75 180 top
D5  178,30.75 180 top
D6  193.5,30.75 180 top
D7  209,30.75 180 top
D8  224.5,30.75 180 top
D9  240,30.75 180 top
D10  255.5,30.75 180 top
D11  116,46.25 180 top
D12  131.5,46.25 180 top
D13  147,46.25 180 top
D14  162.5,46.25 180 top
D15  178,46.25 180 top
D16  193.5,46.25 180 top
D17  209,46.25 180 top
D18  224.5,46.25 180 top
D19  240,46.25 180 top
D20  255.5,46.25 180 top
D21  116,61.75 180 top
D22  131.5,61.75 180 top
D23  147,61.75 180 top
D24  162.5,61.75 180 top
D25  178,61.75 180 top
D26  193.5,61.75 180 top
D27  209,61.75 180 top
D28  224.5,61.75 180 top
D29  240,61.75 180 top
D30  255.5,61.75 180 top
D31  116,77.25 180 top
D32  131.5,77.25 180 top
D33  147,77.25 180 top
D34  162.5,77.25 180 top
D35  178,77.25 180 top
D36  193.5,77.25 180 top
D37  209,77.25 180 top
D38  224.5,77.25 180 top
D39  240,77.25 180 top
D40  255.5,77.25 180 top
D41  116,92.75 180 top
D42  131.5,92.75 180 top
D43  147,92.75 180 top
D44  162.5,92.75 180 top
D45  178,92.75 180 top
D46  193.5,92.75 180 top
D47  209,92.75 180 top
D48  224.5,92.75 180 top
D49  240,92.75 180 top
D50  255.5,92.75 180 top
D51  116,108.25 180 top
D52  131.5,108.25 180 top
D53  147,108.25 180 top
D54  162.5,108.25 180 top
D55  178,108.25 180 top
D56  193.5,108.25 180 top
D57  209,108.25 180 top
D58  224.5,108.25 180 top
D59  240,108.25 180 top
D60  255.5,108.25 180 top
D61  116,123.75 180 top
D62  131.5,123.75 180 top
D63  147,123.75 180 top
D64  162.5,123.75 180 top
D65  178,123.75 180 top
D66  193.5,123.75 180 top
D67  209,123.75 180 top
D68  224.5,123.75 180 top
D69  240,123.75 180 top
D70  255.5,123.75 180 top
D71  293,12 135 top
D72  280,36.59 225 top
D73  318,24 225 top
D74  304.71,49.29 135 top
D75  289,101 180 top
D76  308.75,101 180 top
D77  123.75,15.25 180 top
D78  147,15.25 180 top
D79  224.5,15.25 180 top
D80  247.75,15.25 180 top
D81  253,141.75 180 top
D82  232.25,141.75 180 top
D83  211.5,141.75 180 top
D84  191,141.75 180 top
D85  170.25,141.75 180 top
D86  149.75,141.75 180 top
D87  253,162.5 180 top
D88  232.25,162.5 180 top
D89  211.5,162.5 180 top
D90  191,162.5 180 top
D91  170.25,162.5 180 top
D92  149.75,162.5 180 top
D93  253,183 180 top
D94  232.25,183 180 top
D95  211.5,183 180 top
D96  191,183 180 top
D97  170.25,183 180 top
D98  149.75,183 180 top
D99  98,141.75 180 top
D100  77.25,141.75 180 top
D101  98,162.5 180 top
D102  98,183 180 top
D103  77.25,162.5 180 top
D104  77.25,183 180 top
D105  51.5,147 180 top
D106  51.5,178 180 top
D107  67,121 180 top
D108  67,100.5 180 top
D109  67,79.75 180 top
D110  46.25,121 180 top
D111  46.25,100.5 180 top
D112  46.25,79.75 180 top
D113  46.25,59.25 180 top
D114  46.25,38.5 180 top
D115  46.25,17.5 180 top
U1  298,169 0 bottom
U$1  116,23 0 top
U$2  131.5,23 0 top
U$3  147,23 0 top
U$4  162.5,23 0 top
U$5  178,23 0 top
U$6  193.5,23 0 top
U$7  209,23 0 top
U$8  224.5,23 0 top
U$9  240,23 0 top
U$10  255.5,23 0 top
U$11  116,38.5 0 top
U$12  131.5,38.5 0 top
U$13  147,38.5 0 top
U$14  162.5,38.5 0 top
U$15  178,38.5 0 top
U$16  193.5,38.5 0 top
U$17  209,38.5 0 top
U$18  224.5,38.5 0 top
U$19  240,38.5 0 top
U$20  255.5,38.5 0 top
U$21  116,54 0 top
U$22  131.5,54 0 top
U$23  147,54 0 top
U$24  162.5,54 0 top
U$25  178,54 0 top
U$26  193.5,54 0 top
U$27  209,54 0 top
U$28  224.5,54 0 top
U$29  240,54 0 top
U$30  255.5,54 0 top
U$31  116,69.5 0 top
U$32  131.5,69.5 0 top
U$33  147,69.5 0 top
U$34  162.5,69.5 0 top
U$35  178,69.5 0 top
U$36  193.5,69.5 0 top
U$37  209,69.5 0 top
U$38  224.5,69.5 0 top
U$39  240,69.5 0 top
U$40  255.5,69.5 0 top
U$41  116,85 0 top
U$42  131.5,85 0 top
U$43  147,85 0 top
U$44  162.5,85 0 top
U$45  178,85 0 top
U$46  193.5,85 0 top
U$47  209,85 0 top
U$48  224.5,85 0 top
U$49  240,85 0 top
U$50  255.5,85 0 top
U$51  116,100.5 0 top
U$52  131.5,100.5 0 top
U$53  147,100.5 0 top
U$54  162.5,100.5 0 top
U$55  178,100.5 0 top
U$56  193.5,100.5 0 top
U$57  209,100.5 0 top
U$58  224.5,100.5 0 top
U$59  240,100.5 0 top
U$60  255.5,100.5 0 top
U$61  116,116 0 top
U$62  131.5,116 0 top
U$63  147,116 0 top
U$64  162.5,116 0 top
U$65  178,116 0 top
U$66  193.5,116 0 top
U$67  209,116 0 top
U$68  224.5,116 0 top
U$69  240,116 0 top
U$70  255.5,116 0 top
U$71  299,18 135 top
U$72  286.25,30.75 45 top
U$73  311.75,30.75 225 top
U$74  298.93,43.47 315 top
U$75  289.25,92.75 0 top
U$76  308.75,92.75 0 top
U$77  123.75,7.5 0 top
U$78  147,7.5 0 top
U$79  224.5,7.5 0 top
U$80  247.75,7.5 0 top
U$81  253,134 0 top
U$82  232.25,134 0 top
U$83  211.5,134 0 top
U$84  191,134 0 top
U$85  170.25,134 0 top
U$86  149.75,134 0 top
U$87  253,154.75 0 top
U$88  232.25,154.75 0 top
U$89  211.5,154.75 0 top
U$90  191,154.75 0 top
U$91  170.25,154.75 0 top
U$92  149.75,154.75 0 top
U$93  253,175.25 0 top
U$94  232.25,175.25 0 top
U$95  211.5,175.25 0 top
U$96  191,175.25 0 top
U$97  170.25,175.25 0 top
U$98  149.75,175.25 0 top
U$99  98,134 0 top
U$100  77.25,134 0 top
U$101  98,154.75 0 top
U$102  98,175.25 0 top
U$103  77.25,154.75 0 top
U$104  77.25,175.25 0 top
U$105  51.5,139.25 0 top
U$106  51.5,170.25 0 top
U$107  67,113.25 0 top
U$108  67,92.75 0 top
U$109  67,72 0 top
U$110  46.25,113.25 0 top
U$111  46.25,92.75 0 top
U$112  46.25,72 0 top
U$113  46.25,51.5 0 top
U$114  46.25,30.75 0 top
U$115  46.25,9.75 0 top
U$116  [STAND-OFF]  5,5 0 top
U$117  [STAND-OFF]  325,5 0 top
U$118  [STAND-OFF]  5,181 0 top
U$119  [STAND-OFF]  325,180 0 top
U$120  20,139 90 bottom
U$121  124,170 180 bottom
U$122  274,155 90 top
U$123  20,72 90 bottom
U$124  [SPHINX#SVG0]  -7.62,175.26 0 top  (outside the outline)

### Tracks (layer width: path | path; a pad name or v marks a point on that pad's centre or on a via)
5V
  Top 0.254: U$121.6 U$121.5 124,170.99 123.19,170.18 115.57,170.18 113.84,168.45 U$121.18 | U$120.6 18.48,141.54 20.32,139.7 20.32,130.81 22.29,128.84 U$120.18 | U$123.6 U$123.5 U$123.4 19.44,69.46 20.32,68.58 20.32,62.23 20.71,61.84 U$123.18
  Bottom 0.254: U1.21 283.3,174.08 281.94,172.72 281.94,160.02 279.4,157.48 277.87,157.48 U$122.6 273.11,157.54 | 273.11,157.54 273.05,157.54 273.05,166.37 270.51,168.91 113.84,168.91 | 273.11,157.54 273.05,157.48 273.05,152.4 | 273.05,152.4 277.75,152.4 U$122.4 | U$122.18 271.84,144.84 273.05,146.05 273.05,152.4 | 113.84,168.91 U$121.18 | 113.84,168.91 64.77,168.91 60.96,165.1 22.86,165.1 20.32,162.56 20.32,128.27 | U$120.18 23.24,128.27 20.32,128.27 | U$123.18 20.71,61.84 20.32,62.23 20.32,128.27
COL0
  Top 0.254: D115.C 42.44,25.92 42.82,26.3 42.82,31.61 42.44,31.98 D114.C 42.44,46.67 42.82,47.05 42.82,52.36 42.44,52.73 D113.C 42.44,67.17 42.82,67.55 42.82,72.86 42.44,73.23 D112.C 42.44,87.92 42.82,88.3 42.82,93.61 42.44,93.98 D111.C 42.44,108.42 42.82,108.8 42.82,114.11 42.44,114.48 D110.C 42.44,123.72 44.45,125.73 104.14,125.73 116.38,137.97 U$121.17
COL1
  Top 0.254: D109.C 63.19,87.92 63.57,88.3 63.57,93.61 63.19,93.98 D108.C 63.19,108.42 63.57,108.8 63.57,114.11 63.19,114.48 D107.C 63.19,122.27 64.11,123.19 105.41,123.19 118.92,136.7 U$121.16
COL2  (via drill 0.38)
  Top 0.254: D106.C 47.69,171.49 48.07,171.11 48.07,165.8 47.69,165.42 D105.C 47.69,142.81 48.26,142.24 v48.26,134.62 | D77.C 116.83,15.25 112.57,19.51 112.57,23.86 112.19,24.23 D1.C 112.19,33.67 112.57,34.05 112.57,39.36 112.19,39.73 D11.C 112.19,49.17 112.57,49.55 112.57,54.86 112.19,55.23 D21.C 112.19,64.67 112.57,65.05 112.57,70.36 112.19,70.73 D31.C 112.19,80.17 112.57,80.55 112.57,85.86 112.19,86.23 D41.C 112.19,95.67 112.57,96.05 112.57,101.36 112.19,101.73 D51.C 112.19,111.17 112.57,111.55 112.57,116.86 112.19,117.23 D61.C 112.19,126.16 v118.11,132.08 121.46,135.43 U$121.15
  Bottom 0.254: v48.26,134.62 55.88,134.62 58.51,132 98.83,132 98.92,132.08 v118.11,132.08
COL3  (via drill 0.38)
  Top 0.254: D104.C 73.44,176.49 73.82,176.11 73.82,170.8 73.44,170.42 D103.C 73.44,155.99 73.82,155.61 73.82,150.3 73.44,149.92 D100.C 73.44,136.11 v73.66,135.89 | D2.C 127.69,33.67 128.07,34.05 128.07,39.36 127.69,39.73 D12.C 127.69,49.17 128.07,49.55 128.07,54.86 127.69,55.23 D22.C 127.69,64.67 128.07,65.05 128.07,70.36 127.69,70.73 D32.C 127.69,80.17 128.07,80.55 128.07,85.86 127.69,86.23 D42.C 127.69,95.67 128.07,96.05 128.07,101.36 127.69,101.73 D52.C 127.69,111.17 128.07,111.55 128.07,116.86 127.69,117.23 D62.C 127.69,131.39 v124.46,134.62 124,135.08 U$121.14
  Bottom 0.254: v124.46,134.62 107.95,134.62 106.56,136 76.42,136 76.31,135.89 v73.66,135.89
COL4  (via drill 0.38)
  Top 0.254: D102.C 94.19,176.49 94.57,176.11 94.57,170.8 94.19,170.42 D101.C 94.19,155.99 94.57,155.61 94.57,150.3 94.19,149.92 D99.C | D78.C 143.19,18.17 143.57,18.55 143.57,23.86 143.19,24.23 D3.C 143.19,33.67 143.57,34.05 143.57,39.36 143.19,39.73 D13.C 143.19,49.17 143.57,49.55 143.57,54.86 143.19,55.23 D23.C 143.19,64.67 143.57,65.05 143.57,70.36 143.19,70.73 D33.C 143.19,80.17 143.57,80.55 143.57,85.86 143.19,86.23 D43.C 143.19,95.67 143.57,96.05 143.57,101.36 143.19,101.73 D53.C 143.19,111.17 143.57,111.55 143.57,116.86 143.19,117.23 D63.C v126.48,140.46 126.48,143 126.54,143.05 U$121.13
  Bottom 0.254: D99.C 95.95,143.51 123.43,143.51 v126.48,140.46
COL5
  Top 0.254: D4.C 158.69,33.67 159.07,34.05 159.07,39.36 158.69,39.73 D14.C 158.69,49.17 159.07,49.55 159.07,54.86 158.69,55.23 D24.C 158.69,64.67 159.07,65.05 159.07,70.36 158.69,70.73 D34.C 158.69,80.17 159.07,80.55 159.07,85.86 158.69,86.23 D44.C 158.69,95.67 159.07,96.05 159.07,101.36 158.69,101.73 D54.C 158.69,111.17 159.07,111.55 159.07,116.86 158.69,117.23 D64.C 158.69,125.79 157.48,127 144.78,127 129.08,142.7 U$121.12
COL6  (via drill 0.38)
  Top 0.254: D5.C 174.19,33.67 174.57,34.05 174.57,39.36 174.19,39.73 D15.C 174.19,49.17 174.57,49.55 174.57,54.86 174.19,55.23 D25.C 174.19,64.67 174.57,65.05 174.57,70.36 174.19,70.73 D35.C 174.19,80.17 174.57,80.55 174.57,85.86 174.19,86.23 D45.C 174.19,95.67 174.57,96.05 174.57,101.36 174.19,101.73 D55.C 174.19,111.17 174.57,111.55 174.57,116.86 174.19,117.23 D65.C 170.98,126.96 161,126.96 158.42,129.54 149.86,129.54 146.32,133.08 146.32,134.86 145.94,135.24 D86.C 145.94,149.92 146.32,150.3 146.32,155.61 145.94,155.99 D92.C 145.94,170.42 146.32,170.8 146.32,176.11 145.94,176.49 D98.C | U$121.11 131.62,163.02 v132.08,162.56
  Bottom 0.254: v132.08,162.56 145.88,162.56 D92.C
COL7
  Top 0.254: D6.C 189.69,33.67 190.07,34.05 190.07,39.36 189.69,39.73 D16.C 189.69,49.17 190.07,49.55 190.07,54.86 189.69,55.23 D26.C 189.69,64.67 190.07,65.05 190.07,70.36 189.69,70.73 D36.C 189.69,80.17 190.07,80.55 190.07,85.86 189.69,86.23 D46.C 189.69,95.67 190.07,96.05 190.07,101.36 189.69,101.73 D56.C 189.69,111.17 190.07,111.55 190.07,116.86 189.69,117.23 D66.C 183.9,129.54 170.18,129.54 166.82,132.9 166.82,134.86 166.44,135.24 D85.C 166.44,149.92 166.82,150.3 166.82,155.61 166.44,155.99 D91.C 166.44,170.42 166.82,170.8 166.82,176.11 166.44,176.49 D97.C
  Bottom 0.254: U$121.10 162.75,166.19 D91.C
COL8
  Top 0.254: D7.C 205.19,33.67 205.57,34.05 205.57,39.36 205.19,39.73 D17.C 205.19,49.17 205.57,49.55 205.57,54.86 205.19,55.23 D27.C 205.19,64.67 205.57,65.05 205.57,70.36 205.19,70.73 D37.C 205.19,80.17 205.57,80.55 205.57,85.86 205.19,86.23 D47.C 205.19,95.67 205.57,96.05 205.57,101.36 205.19,101.73 D57.C 205.19,111.17 205.57,111.55 205.57,116.86 205.19,117.23 D67.C 199.4,129.54 190.5,129.54 187.57,132.47 187.57,134.86 187.19,135.24 D84.C 187.19,149.92 187.57,150.3 187.57,155.61 187.19,155.99 D90.C 187.19,170.42 187.57,170.8 187.57,176.11 187.19,176.49 D96.C
  Bottom 0.254: U$122.10 269.18,165.16 266.7,167.64 189.23,167.64 187.19,165.6 D90.C
COL9
  Top 0.254: D79.C 220.69,18.17 221.07,18.55 221.07,23.86 220.69,24.23 D8.C 220.69,33.67 221.07,34.05 221.07,39.36 220.69,39.73 D18.C 220.69,49.17 221.07,49.55 221.07,54.86 220.69,55.23 D28.C 220.69,64.67 221.07,65.05 221.07,70.36 220.69,70.73 D38.C 220.69,80.17 221.07,80.55 221.07,85.86 220.69,86.23 D48.C 220.69,95.67 221.07,96.05 221.07,101.36 220.69,101.73 D58.C 220.69,111.17 221.07,111.55 221.07,116.86 220.69,117.23 D68.C 214.9,129.54 210.69,129.54 208.07,132.16 208.07,134.86 207.69,135.24 D83.C 207.69,149.92 208.07,150.3 208.07,155.61 207.69,155.99 D89.C 207.69,170.42 208.07,170.8 208.07,176.11 207.69,176.49 D95.C
  Bottom 0.254: U$122.11 266.44,166.37 208.28,166.37 207.69,165.78 D89.C
COL10
  Top 0.254: D9.C 236.19,33.67 236.57,34.05 236.57,39.36 236.19,39.73 D19.C 236.19,49.17 236.57,49.55 236.57,54.86 236.19,55.23 D29.C 236.19,64.67 236.57,65.05 236.57,70.36 236.19,70.73 D39.C 236.19,80.17 236.57,80.55 236.57,85.86 236.19,86.23 D49.C 236.19,95.67 236.57,96.05 236.57,101.36 236.19,101.73 D59.C 236.19,111.17 236.57,111.55 236.57,116.86 236.19,117.23 D69.C 233.12,123.75 228.82,128.05 228.82,134.86 228.44,135.24 D82.C 228.44,149.92 228.82,150.3 228.82,155.61 228.44,155.99 D88.C 228.44,170.42 228.82,170.8 228.82,176.11 228.44,176.49 D94.C
  Bottom 0.254: U$122.12 265.17,165.1 229.87,165.1 228.44,163.67 D88.C
COL11  (via drill 0.38)
  Top 0.254: D80.C 247.65,18.96 247.65,26.71 D10.C 251.69,33.67 252.07,34.05 252.07,39.36 251.69,39.73 D20.C 251.69,49.17 252.07,49.55 252.07,54.86 251.69,55.23 D30.C 251.69,64.67 252.07,65.05 252.07,70.36 251.69,70.73 D40.C 251.69,80.17 252.07,80.55 252.07,85.86 251.69,86.23 D50.C 251.69,95.67 252.07,96.05 252.07,101.36 251.69,101.73 D60.C 251.69,111.17 252.07,111.55 252.07,116.86 251.69,117.23 D70.C 251.69,129.69 249.57,131.81 249.57,134.86 249.19,135.24 D81.C 249.19,149.92 249.57,150.3 v249.57,152.4 249.57,155.61 249.19,155.99 D87.C 249.19,170.42 249.57,170.8 249.57,176.11 249.19,176.49 D93.C
  Bottom 0.254: U$122.13 270.13,157.48 264.16,157.48 259.08,152.4 v249.57,152.4
COL12  (via drill 0.38)
  Top 0.254: D75.C 285.19,94.23 285.82,93.61 285.82,49.6 277.24,41.02 277.24,33.96 D72.C 277.31,27.69 D71.C | U$122.14 266.76,155 264.16,152.4 264.16,106.68 v269.24,101.6
  Bottom 0.254: v269.24,101.6 269.84,101 D75.C
COL13  (via drill 0.38)
  Top 0.254: D76.C 304.94,93.98 305.32,93.61 305.32,55.29 D74.C 299.98,49.95 299.98,48.93 296.08,45.03 296.08,42.29 313.31,25.07 313.31,23.3 D73.C | U$122.15 268.03,152.46 266.7,151.13 266.7,106.68 v269.24,104.14
  Bottom 0.254: v269.24,104.14 303.53,104.14 304.94,102.73 D76.C
GND
  pour Top (isolate 0.305, hatched): 0,185.5 0,0 330,0 330,185.5
  pour Bottom (isolate 0.305, hatched): 0,185.5 0,0 330,0 330,185.5
N$12
  Top 0.254: U$77.CHOC1 125.71,13.4 D77.A
N$13
  Top 0.254: U$78.CHOC1 148.96,13.4 D78.A
N$14
  Top 0.254: U$79.CHOC1 226.46,13.4 D79.A
N$15
  Top 0.254: U$80.CHOC1 249.71,13.4 D80.A
N$20
  Top 0.254: U$73.CHOC1 320.58,26.58 D73.A
N$22
  Top 0.254: U$71.CHOC1 294.83,10.17 D71.A
N$24
  Top 0.254: D72.A 282.69,35.54 U$72.CHOC1
N$26
  Top 0.254: U$74.CHOC1 306.36,47.64 D74.A
N$28
  Top 0.254: U$20.CHOC1 257.46,44.4 D20.A
N$30
  Top 0.254: U$10.CHOC1 257.46,28.9 D10.A
N$32
  Top 0.254: U$9.CHOC1 241.96,28.9 D9.A
N$34
  Top 0.254: D8.A 226.46,28.9 U$8.CHOC1
N$36
  Top 0.254: U$7.CHOC1 210.96,28.9 D7.A
N$38
  Top 0.254: U$17.CHOC1 210.96,44.4 D17.A
N$40
  Top 0.254: D18.A 226.46,44.4 U$18.CHOC1
N$42
  Top 0.254: U$19.CHOC1 241.96,44.4 D19.A
N$44
  Top 0.254: U$16.CHOC1 195.46,44.4 D16.A
N$46
  Top 0.254: U$6.CHOC1 195.46,28.9 D6.A
N$48
  Top 0.254: U$5.CHOC1 179.96,28.9 D5.A
N$50
  Top 0.254: U$4.CHOC1 164.46,28.9 D4.A
N$52
  Top 0.254: U$3.CHOC1 148.96,28.9 D3.A
N$54
  Top 0.254: U$15.CHOC1 179.96,44.4 D15.A
N$56
  Top 0.254: U$14.CHOC1 164.46,44.4 D14.A
N$58
  Top 0.254: U$13.CHOC1 148.96,44.4 D13.A
N$60
  Top 0.254: U$12.CHOC1 133.46,44.4 D12.A
N$62
  Top 0.254: D2.A 133.46,28.9 U$2.CHOC1
N$64
  Top 0.254: D1.A 117.96,28.9 U$1.CHOC1
N$67
  Top 0.254: U$11.CHOC1 117.96,44.4 D11.A
N$68
  Top 0.254: U$50.CHOC1 257.46,90.9 D50.A
N$70
  Top 0.254: U$40.CHOC1 257.46,75.4 D40.A
N$72
  Top 0.254: U$30.CHOC1 257.46,59.9 D30.A
N$75
  Top 0.254: U$29.CHOC1 241.96,59.9 D29.A
N$76
  Top 0.254: U$39.CHOC1 241.96,75.4 D39.A
N$78
  Top 0.254: U$49.CHOC1 241.96,90.9 D49.A
N$80
  Top 0.254: U$48.CHOC1 226.46,90.9 D48.A
N$82
  Top 0.254: U$38.CHOC1 226.46,75.4 D38.A
N$84
  Top 0.254: D28.A 226.46,59.9 U$28.CHOC1
N$86
  Top 0.254: U$27.CHOC1 210.96,59.9 D27.A
N$88
  Top 0.254: U$37.CHOC1 210.96,75.4 D37.A
N$90
  Top 0.254: U$47.CHOC1 210.96,90.9 D47.A
N$92
  Top 0.254: U$46.CHOC1 195.46,90.9 D46.A
N$94
  Top 0.254: U$36.CHOC1 195.46,75.4 D36.A
N$96
  Top 0.254: U$26.CHOC1 195.46,59.9 D26.A
N$98
  Top 0.254: U$25.CHOC1 179.96,59.9 D25.A
N$100
  Top 0.254: U$35.CHOC1 179.96,75.4 D35.A
N$102
  Top 0.254: U$45.CHOC1 179.96,90.9 D45.A
N$104
  Top 0.254: U$44.CHOC1 164.46,90.9 D44.A
N$105
  Top 0.254: U$43.CHOC1 148.96,90.9 D43.A
N$106
  Top 0.254: U$42.CHOC1 133.46,90.9 D42.A
N$107
  Top 0.254: U$41.CHOC1 117.96,90.9 D41.A
N$108
  Top 0.254: U$31.CHOC1 117.96,75.4 D31.A
N$109
  Top 0.254: U$32.CHOC1 133.46,75.4 D32.A
N$110
  Top 0.254: U$33.CHOC1 148.96,75.4 D33.A
N$111
  Top 0.254: U$34.CHOC1 164.46,75.4 D34.A
N$112
  Top 0.254: U$24.CHOC1 164.46,59.9 D24.A
N$113
  Top 0.254: U$23.CHOC1 148.96,59.9 D23.A
N$114
  Top 0.254: U$22.CHOC1 133.46,59.9 D22.A
N$115
  Top 0.254: U$21.CHOC1 117.96,59.9 D21.A
N$128
  Top 0.254: U$70.CHOC1 257.46,121.9 D70.A
N$129
  Top 0.254: U$69.CHOC1 241.96,121.9 D69.A
N$130
  Top 0.254: U$68.CHOC1 226.46,121.9 D68.A
N$131
  Top 0.254: U$67.CHOC1 210.96,121.9 D67.A
N$132
  Top 0.254: U$66.CHOC1 195.46,121.9 D66.A
N$133
  Top 0.254: U$56.CHOC1 195.46,106.4 D56.A
N$134
  Top 0.254: U$57.CHOC1 210.96,106.4 D57.A
N$135
  Top 0.254: U$58.CHOC1 226.46,106.4 D58.A
N$136
  Top 0.254: U$59.CHOC1 241.96,106.4 D59.A
N$137
  Top 0.254: U$60.CHOC1 257.46,106.4 D60.A
N$148
  Top 0.254: U$65.CHOC1 179.96,121.9 D65.A
N$149
  Top 0.254: U$55.CHOC1 179.96,106.4 D55.A
N$150
  Top 0.254: U$54.CHOC1 164.46,106.4 D54.A
N$151
  Top 0.254: U$64.CHOC1 164.46,121.9 D64.A
N$152
  Top 0.254: U$63.CHOC1 148.96,121.9 D63.A
N$153
  Top 0.254: U$53.CHOC1 148.96,106.4 D53.A
N$154
  Top 0.254: U$52.CHOC1 133.46,106.4 D52.A
N$155
  Top 0.254: U$62.CHOC1 133.46,121.9 D62.A
N$156
  Top 0.254: U$61.CHOC1 117.96,121.9 D61.A
N$157
  Top 0.254: U$51.CHOC1 117.96,106.4 D51.A
N$168
  Top 0.254: U$107.CHOC1 68.96,119.15 D107.A
N$169
  Top 0.254: U$108.CHOC1 68.96,98.65 D108.A
N$170
  Top 0.254: U$111.CHOC1 48.21,98.65 D111.A
N$171
  Top 0.254: U$110.CHOC1 48.21,119.15 D110.A
N$176
  Top 0.254: U$109.CHOC1 68.96,77.9 D109.A
N$177
  Top 0.254: U$112.CHOC1 48.21,77.9 D112.A
N$178
  Top 0.254: U$113.CHOC1 48.21,57.4 D113.A
N$179
  Top 0.254: U$114.CHOC1 48.21,36.65 D114.A
N$184
  Top 0.254: U$115.CHOC1 48.21,15.65 D115.A
N$186
  Top 0.254: U$76.CHOC1 310.21,98.65 D76.A
N$188
  Top 0.254: U$75.CHOC1 290.46,98.65 D75.A
N$190
  Top 0.254: U$93.CHOC1 254.96,181.15 D93.A
N$191
  Top 0.254: U$87.CHOC1 254.96,160.65 D87.A
N$192
  Top 0.254: U$81.CHOC1 254.96,139.9 D81.A
N$193
  Top 0.254: U$82.CHOC1 234.21,139.9 D82.A
N$194
  Top 0.254: U$88.CHOC1 234.21,160.65 D88.A
N$195
  Top 0.254: U$94.CHOC1 234.21,181.15 D94.A
N$196
  Top 0.254: U$95.CHOC1 213.46,181.15 D95.A
N$197
  Top 0.254: U$89.CHOC1 213.46,160.65 D89.A
N$198
  Top 0.254: U$83.CHOC1 213.46,139.9 D83.A
N$199
  Top 0.254: U$84.CHOC1 192.96,139.9 D84.A
N$200
  Top 0.254: U$90.CHOC1 192.96,160.65 D90.A
N$201
  Top 0.254: U$96.CHOC1 192.96,181.15 D96.A
N$202
  Top 0.254: U$97.CHOC1 172.21,181.15 D97.A
N$203
  Top 0.254: U$98.CHOC1 151.71,181.15 D98.A
N$204
  Top 0.254: U$92.CHOC1 151.71,160.65 D92.A
N$205
  Top 0.254: U$91.CHOC1 172.21,160.65 D91.A
N$206
  Top 0.254: U$85.CHOC1 172.21,139.9 D85.A
N$207
  Top 0.254: U$86.CHOC1 151.71,139.9 D86.A
N$226
  Top 0.254: U$102.CHOC1 99.96,181.15 D102.A
N$227
  Top 0.254: U$104.CHOC1 79.21,181.15 D104.A
N$228
  Top 0.254: U$106.CHOC1 53.46,176.15 D106.A
N$229
  Top 0.254: U$103.CHOC1 79.21,160.65 D103.A
N$230
  Top 0.254: U$101.CHOC1 99.96,160.65 D101.A
N$231
  Top 0.254: U$99.CHOC1 99.96,139.9 D99.A
N$232
  Top 0.254: U$100.CHOC1 79.21,139.9 D100.A
N$233
  Top 0.254: U$105.CHOC1 53.46,145.15 D105.A
ROW0
  Bottom 0.254: U$80.CHOC2 U$79.CHOC2 U$78.CHOC2 U$77.CHOC2 112.9,11.3 104.14,2.54 38.1,2.54 26.67,13.97 26.67,63.5 25.79,64.38 U$123.17
ROW1
  Bottom 0.254: U$73.CHOC2 309.23,22.86 299.34,22.86 295.33,18.85 U$71.CHOC2 273.25,18.85 265.3,26.8 U$10.CHOC2 U$9.CHOC2 U$8.CHOC2 U$7.CHOC2 U$6.CHOC2 U$5.CHOC2 U$4.CHOC2 U$3.CHOC2 U$2.CHOC2 U$1.CHOC2 108.08,26.8 85.09,3.81 39.37,3.81 27.94,15.24 27.94,66.04 27.06,66.92 U$123.16
ROW2
  Bottom 0.254: 290.19,40.01 287.9,42.3 U$20.CHOC2 U$19.CHOC2 U$18.CHOC2 U$17.CHOC2 U$16.CHOC2 U$15.CHOC2 U$14.CHOC2 U$13.CHOC2 U$12.CHOC2 U$11.CHOC2 105.8,42.3 77.05,13.55 U$115.CHOC2 34.71,13.55 29.21,19.05 29.21,67.31 27.06,69.46 U$123.15 | 290.19,40.01 299.72,30.48 305.15,35.91 U$74.CHOC2 | U$72.CHOC2 290.13,40.01 290.19,40.01
ROW3
  Bottom 0.254: U$30.CHOC2 U$29.CHOC2 U$28.CHOC2 U$27.CHOC2 U$26.CHOC2 U$25.CHOC2 U$24.CHOC2 U$23.CHOC2 U$22.CHOC2 U$21.CHOC2 106.06,57.8 82.81,34.55 U$114.CHOC2 34.03,34.55 30.48,38.1 30.48,68.58 27.06,72 U$123.14
ROW4
  Bottom 0.254: U$40.CHOC2 U$39.CHOC2 U$38.CHOC2 U$37.CHOC2 U$36.CHOC2 U$35.CHOC2 U$34.CHOC2 U$33.CHOC2 U$32.CHOC2 U$31.CHOC2 106.32,73.3 88.32,55.3 U$113.CHOC2 34.87,55.3 31.75,58.42 31.75,69.85 27.06,74.54 U$123.13
ROW5
  Bottom 0.254: U$50.CHOC2 U$49.CHOC2 U$48.CHOC2 U$47.CHOC2 U$46.CHOC2 U$45.CHOC2 U$44.CHOC2 U$43.CHOC2 U$42.CHOC2 U$41.CHOC2 120.9,88.9 106.68,88.9 93.58,75.8 U$109.CHOC2 U$112.CHOC2 28.34,75.8 27.06,77.08 U$123.12
ROW6
  Bottom 0.254: U$76.CHOC2 U$75.CHOC2 271.75,96.55 264,104.3 U$60.CHOC2 U$59.CHOC2 U$58.CHOC2 U$57.CHOC2 U$56.CHOC2 U$55.CHOC2 U$54.CHOC2 U$53.CHOC2 U$52.CHOC2 U$51.CHOC2 106.84,104.3 99.09,96.55 U$108.CHOC2 U$111.CHOC2 33.05,96.55 29.21,92.71 29.21,81.28 27.55,79.62 U$123.11
ROW7
  Bottom 0.254: U$70.CHOC2 U$69.CHOC2 U$68.CHOC2 U$67.CHOC2 U$66.CHOC2 U$65.CHOC2 U$64.CHOC2 U$63.CHOC2 U$62.CHOC2 U$61.CHOC2 107.1,119.8 104.35,117.05 U$107.CHOC2 U$110.CHOC2 28.15,117.05 23.81,112.71 U$123.10
ROW8
  Bottom 0.254: U$81.CHOC2 U$82.CHOC2 U$83.CHOC2 U$84.CHOC2 U$85.CHOC2 U$86.CHOC2 U$99.CHOC2 U$100.CHOC2 66.83,137.8 61.58,143.05 U$105.CHOC2 41.45,143.05 29.78,131.38 U$120.17
ROW9
  Bottom 0.254: U$87.CHOC2 U$88.CHOC2 U$89.CHOC2 U$90.CHOC2 U$91.CHOC2 U$92.CHOC2 U$101.CHOC2 U$103.CHOC2 51.87,158.55 27.24,133.92 U$120.16
ROW10  (via drill 0.38)
  Top 0.254: v30.48,173.99 30.48,139.7 27.24,136.46 U$120.15
  Bottom 0.254: U$93.CHOC2 U$94.CHOC2 U$95.CHOC2 U$96.CHOC2 U$97.CHOC2 U$98.CHOC2 U$102.CHOC2 U$104.CHOC2 69.12,179.05 64.12,174.05 U$106.CHOC2 30.54,174.05 v30.48,173.99
SCL  (via drill 0.38)
  Top 0.254: U$122.1 274.32,148.33 v274.32,171.45
  Bottom 0.254: U$122.1 294.7,144.84 299.72,149.86 299.72,165.1 303.62,169 U1.6 | v274.32,171.45 273.05,170.18 113.84,170.18 | 113.84,170.18 U$121.1 | 19.05,128.84 19.05,129.54 19.05,163.83 22.86,167.64 60.96,167.64 63.5,170.18 113.84,170.18 | 19.05,128.84 U$120.1 | 19.05,128.84 19.05,62.23 18.66,61.84 U$123.1
SDA  (via drill 0.38)
  Top 0.254: U$122.2 276.8,147.38 275.59,148.59 v275.59,172.72
  Bottom 0.254: U$122.2 292.16,147.38 297.18,152.4 297.18,165.1 303.62,171.54 U1.5 | v275.59,172.72 274.89,172.02 144.65,172.02 144.07,171.45 118.11,171.45 116.38,173.18 U$121.2 116.38,175.72 114.84,177.25 69.31,177.25 63.5,171.45 57.54,171.45 56.73,172.25 46.27,172.25 45.46,171.45 16.51,171.45 12.7,167.64 12.7,132.08 12.7,131.38 | 12.7,131.38 U$120.2 | 12.7,131.38 12.7,66.04 14.36,64.38 U$123.2

### Text on the board
tPlace: ГКНТ